# EAGLE design practice (EAGLE 6.2)
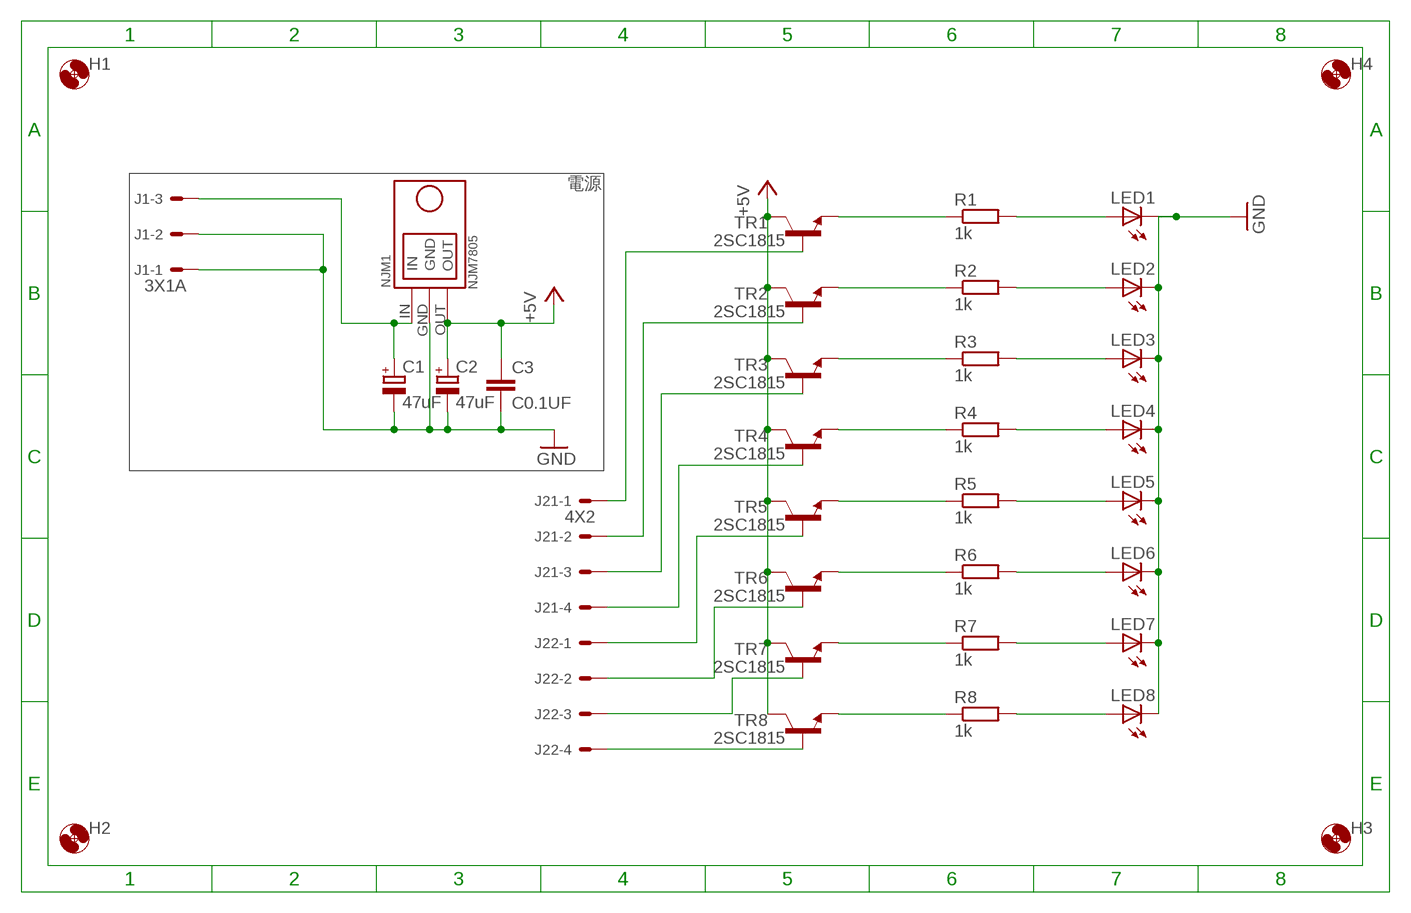
[diagram p0: schematic, sheet 1]

## Parts
C1  47uF  CPOL-EU2-5MM  [E2-5]
C2  47uF  CPOL-EU2-5MM  [E2-5]
C3  C0.1UF  [C0.1UF]
H1  HOLE3.3M3BOLT  [HOLE3.3]
H2  HOLE3.3M3BOLT  [HOLE3.3]
H3  HOLE3.3M3BOLT  [HOLE3.3]
H4  HOLE3.3M3BOLT  [HOLE3.3]
J1  3X1A  [37203-62A3-003]
J2  4X2  [37208-62A3-004]
LED1  LED5MM  [LED5MM]
LED2  LED5MM  [LED5MM]
LED3  LED5MM  [LED5MM]
LED4  LED5MM  [LED5MM]
LED5  LED5MM  [LED5MM]
LED6  LED5MM  [LED5MM]
LED7  LED5MM  [LED5MM]
LED8  LED5MM  [LED5MM]
NJM1  NJM7805  [NJM7805]
R1  1k  R-EU_R3216W  [R3216W]
R2  1k  R-EU_R3216W  [R3216W]
R3  1k  R-EU_R3216W  [R3216W]
R4  1k  R-EU_R3216W  [R3216W]
R5  1k  R-EU_R3216W  [R3216W]
R6  1k  R-EU_R3216W  [R3216W]
R7  1k  R-EU_R3216W  [R3216W]
R8  1k  R-EU_R3216W  [R3216W]
TR1  2SC1815  [TO92-]
TR2  2SC1815  [TO92-]
TR3  2SC1815  [TO92-]
TR4  2SC1815  [TO92-]
TR5  2SC1815  [TO92-]
TR6  2SC1815  [TO92-]
TR7  2SC1815  [TO92-]
TR8  2SC1815  [TO92-]

## Nets
+5V: C2.+ C3.1 NJM1.OUT TR1.C TR2.C TR3.C TR4.C TR5.C TR6.C TR7.C TR8.C
GND: C1.- C2.- C3.2 J1.1-1 J1.1-2 LED1.K(C) LED2.K(C) LED3.K(C) LED4.K(C) LED5.K(C) LED6.K(C) LED7.K(C) LED8.K(C) NJM1.GND
N$1: C1.+ J1.1-3 NJM1.IN
N$2: R1.1 TR1.E
N$3: R2.1 TR2.E
N$4: R3.1 TR3.E
N$5: R4.1 TR4.E
N$6: R5.1 TR5.E
N$7: R6.1 TR6.E
N$8: R7.1 TR7.E
N$9: R8.1 TR8.E
N$10: LED5.A R5.2
N$11: LED6.A R6.2
N$12: LED7.A R7.2
N$13: LED8.A R8.2
N$14: LED1.A R1.2
N$15: LED2.A R2.2
N$16: LED3.A R3.2
N$17: LED4.A R4.2
N$18: J2.1-1 TR1.B
N$19: J2.1-2 TR2.B
N$20: J2.1-3 TR3.B
N$21: J2.1-4 TR4.B
N$22: J2.2-1 TR5.B
N$23: J2.2-2 TR6.B
N$24: J2.2-3 TR7.B
N$25: J2.2-4 TR8.B

## Notes on the sheet
- 電源

## Library data of the parts
C1 C2 = FP-21T for MITS:CPOL-EU2
C3 = FP-21T for MITS:C0.1UF
H1-H4 = FP-21T for MITS:HOLE3.3
J1 = 3M_372xx:3X1
J2 = 3M_372xx:4X2
LED1-LED8 = FP-21T for MITS:LED: LED OSRAM: - CHIPLED LG R971, LG N971, LY N971, LG Q971, LY Q971, LO R971, LY R971 LH N974, LH R974 LS Q976, LO Q976, LY Q976 LO Q996 - Hyper CHIPLED LW Q18S LB Q993, LB Q99A, LB R99A - SideLED LS A670, LO A670, LY A670, LG A670, LP A670 LB A673, LV A673, LT A673, LW A673 LH A674 LY A675 LS A676, LA A676, LO A676, LY A676, LW A676 LS A679, LY A679, LG A679 - Hyper Micro SIDELED® LS Y876, LA Y876, LO Y876, LY Y876 LT Y87S - SmartLED LW L88C, LW L88S LB L89C, LB L89S, LG L890 LS L89K, LO L89K, LY L89K LS L896, LA L896, LO L896, LY L896 - TOPLED LS T670, LO T670, LY T670, LG T670, LP T670 LSG T670, LSP T670, LSY T670, LOP T670, LYG T670 LG T671, LOG T671, LSG T671 LB T673, LV T673, LT T673, LW T673 LH T674 LS T676, LA T676, LO T676, LY T676, LB T676, LH T676, LSB T676, LW T676 LB T67C, LV T67C, LT T67C, LS T67K, LO T67K, LY T67K, LW E67C LS E67B, LA E67B, LO E67B, LY E67B, LB E67C, LV E67C, LT E67C LW T67C LS T679, LY T679, LG T679 LS T770, LO T770, LY T770, LG T770, LP T770 LB T773, LV T773, LT T773, LW T773 LH T774 LS E675, LA E675, LY E675, LS T675 LS T776, LA T776, LO T776, LY T776, LB T776 LHGB T686 LT T68C, LB T68C - Hyper Mini TOPLED® LB M676 - Mini TOPLED Santana® LG M470 LS M47K, LO M47K, LY M47K Source: http://www.osram.convergy.de - LUMILED® LXK2-PW12-R00, LXK2-PW12-S00, LXK2-PW14-U00, LXK2-PW14-V00 LXK2-PM12-R00, LXK2-PM12-S00, LXK2-PM14-U00 LXK2-PE12-Q00, LXK2-PE12-R00, LXK2-PE12-S00, LXK2-PE14-T00, LXK2-PE14-U00 LXK2-PB12-K00, LXK2-PB12-L00, LXK2-PB12-M00, LXK2-PB14-N00, LXK2-PB14-P00, LXK2-PB14-Q00 LXK2-PR12-L00, LXK2-PR12-M00, LXK2-PR14-Q00, LXK2-PR14-R00 LXK2-PD12-Q00, LXK2-PD12-R00, LXK2-PD12-S00 LXK2-PH12-R00, LXK2-PH12-S00 LXK2-PL12-P00, LXK2-PL12-Q00, LXK2-PL12-R00 Source: www.luxeon.com
NJM1 = My_NJM7805:NJM7805
R1-R8 = rcl:R-EU_: RESISTOR, European symbol
TR1-TR8 = FP-21T for MITS:2SC1815

## Board
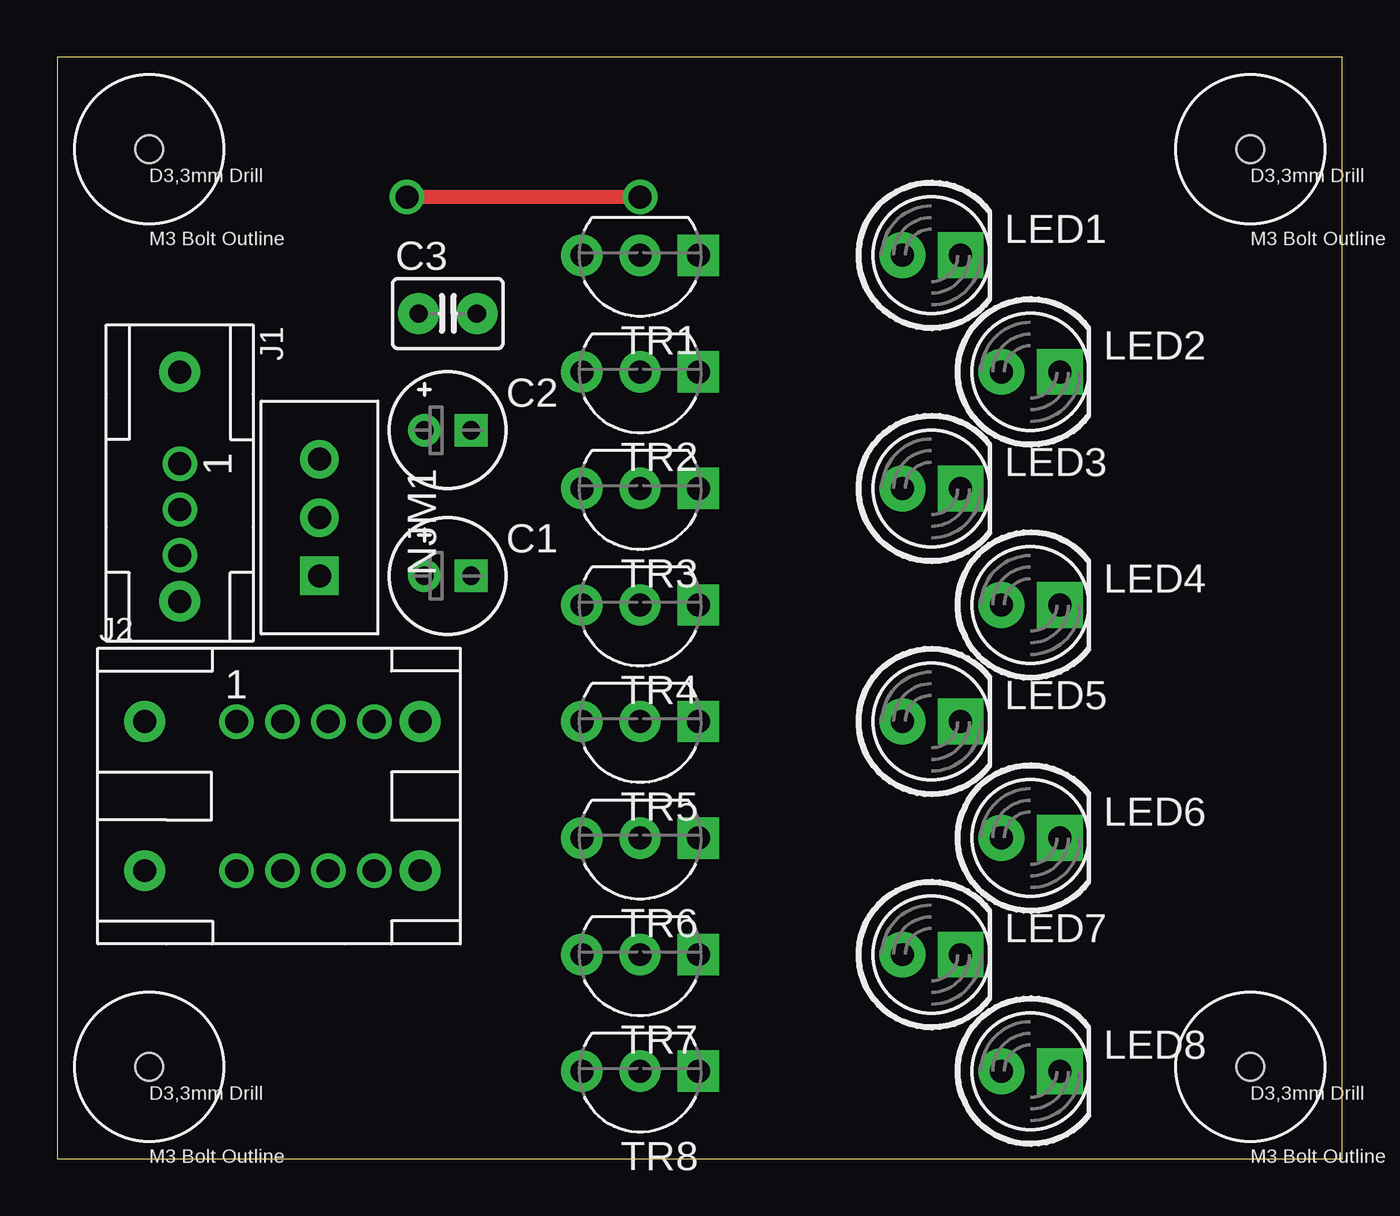
[diagram p1: board, top side]
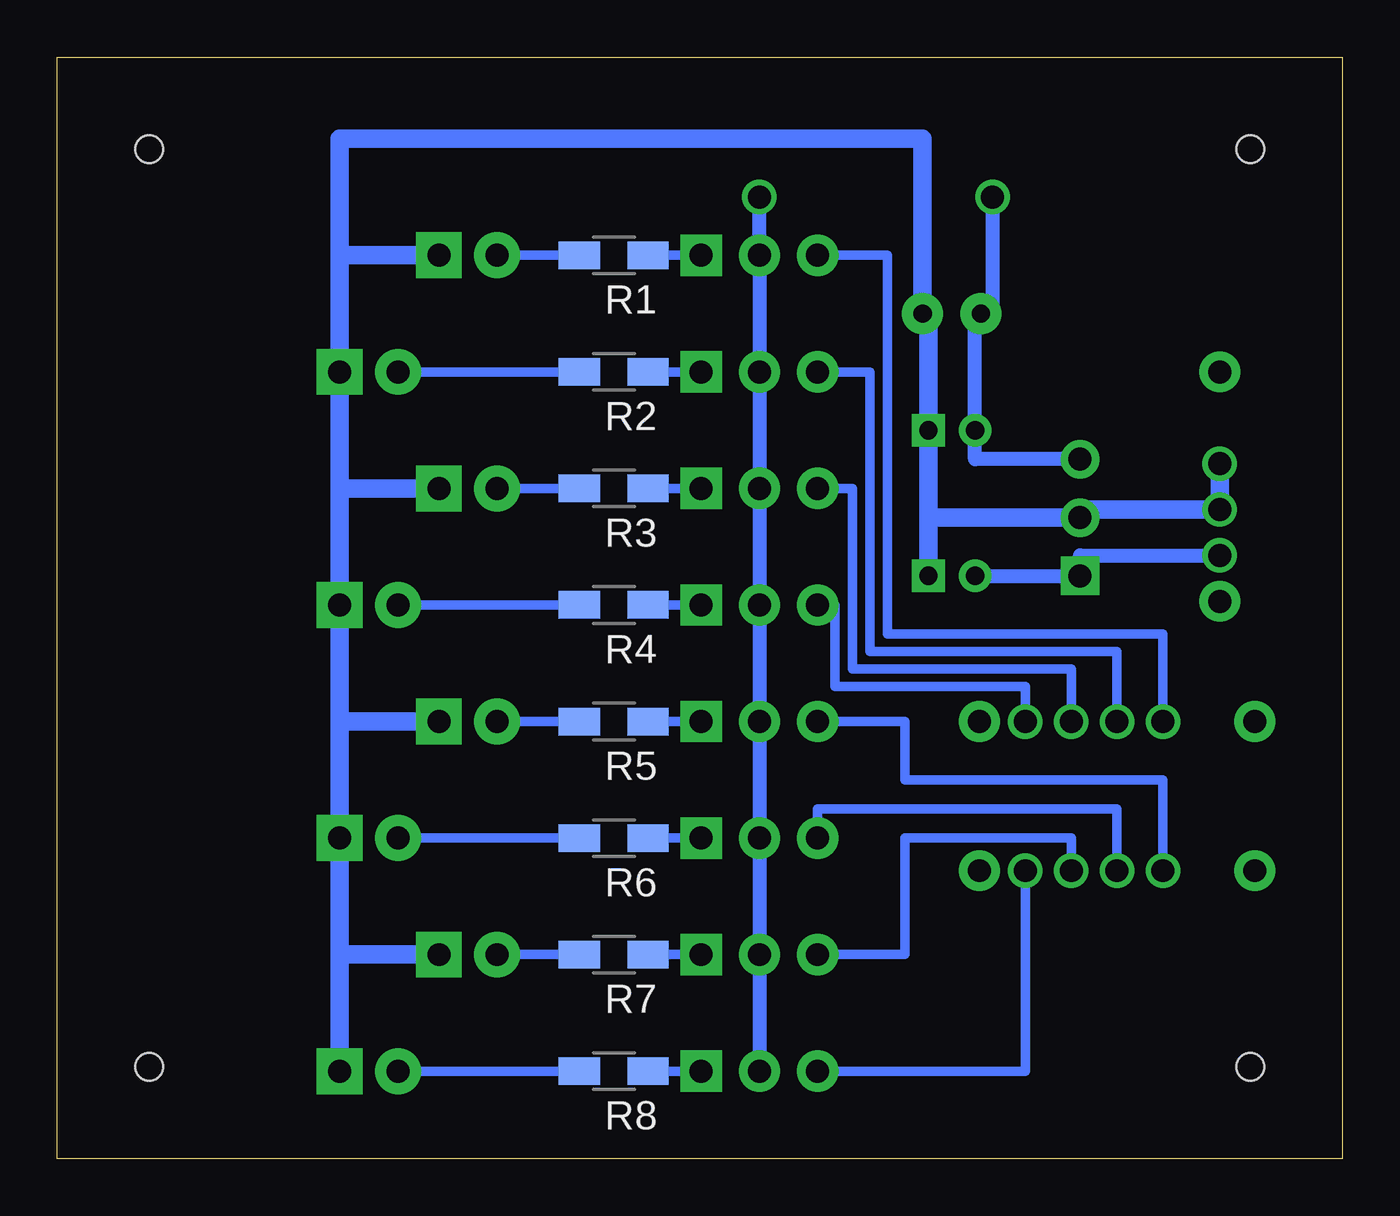
[diagram p2: board, bottom side, seen from below]

Size 56 x 48 mm. Coordinates in mm from the lower left corner, seen from the top.
Outline: 0,0 56,0 56,48 0,48 0,0
Copper layers (1*16): Top 0.035mm / dielectric 1.5mm / Bottom 0.035mm
Design rules: minimum track width 0.15mm, minimum drill 0.3mm, track to track 0.25mm, track to pad 0.25mm, pad to pad 0.25mm, via to via 0.25mm, smd to smd 0.2mm, copper to edge 0.7mm, drill to drill 0.45mm, minimum pad ring 0.15mm, minimum via ring 0.15mm, stop-mask expansion 4mil, vias tented up to drill 0mil, thermal gap 0.15mm

### Footprints (pad centres in the part's own frame; a part is rotated, then mirrored left to right if it is on the bottom)
E2-5 = drill 0.8 pad 1.422: + -1.016,0 | drill 0.8 pad 1.422 square: - 1.016,0
C0.1UF = drill 0.8 pad 1.778: 1 -1.27,0; 2 1.27,0
HOLE3.3 = hole 1.2: 0,0
37203-62A3-003 = drill 1: 1-1 0,4; 1-2 0,6; 1-3 0,8 | drill 1 pad 1.778: P$1 0,0; P$2 0,10
37208-62A3-004 = drill 1: 1-1 0,4; 1-2 0,6; 1-3 0,8; 1-4 0,10; 2-1 6.5,4; 2-2 6.5,6; 2-3 6.5,8; 2-4 6.5,10 | drill 1 pad 1.778: P$1 0,0; P$2 0,12; P$3 6.5,0; P$4 6.5,12
LED5MM = drill 1 pad 2: A -1.27,0 | drill 1 pad 2 square: K 1.27,0
NJM7805 = drill 1 pad 1.676: GND 0,0; OUT 2.54,0 | drill 1 pad 1.676 square: IN -2.54,0
R3216W = smd 1.8 x 1.2: 1 -1.499,0; 2 1.499,0
TO92- = drill 1 pad 1.8: B 2.54,0; C 0,0 | drill 1 pad 1.8 square: E -2.54,0

### Placement (x,y rotation side)
C1  17.02,25.4 0 top
C2  17.02,31.75 0 top
C3  17.02,36.83 0 top
H1  4,4 0 top
H2  52,4 0 top
H3  4,44 0 top
H4  52,44 0 top
J1  5.33,34.29 180 top
J2  3.81,19.05 270 top
LED1  38.1,39.37 0 top
LED2  42.42,34.29 0 top
LED3  38.1,29.21 0 top
LED4  42.42,24.13 0 top
LED5  38.1,19.05 0 top
LED6  42.42,13.97 0 top
LED7  38.1,8.89 0 top
LED8  42.42,3.81 0 top
NJM1  11.43,27.94 90 top
R1  31.75,39.37 180 bottom
R2  31.75,34.29 180 bottom
R3  31.75,29.21 180 bottom
R4  31.75,24.13 180 bottom
R5  31.75,19.05 180 bottom
R6  31.75,13.97 180 bottom
R7  31.75,8.89 180 bottom
R8  31.75,3.81 180 bottom
TR1  25.4,39.37 180 top
TR2  25.4,34.29 180 top
TR3  25.4,29.21 180 top
TR4  25.4,24.13 180 top
TR5  25.4,19.05 180 top
TR6  25.4,13.97 180 top
TR7  25.4,8.89 180 top
TR8  25.4,3.81 180 top

### Tracks (layer width: path | path; a pad name or v marks a point on that pad's centre or on a via)
+5V  (via drill 1)
  Top 0.61: v25.4,41.91 v15.24,41.91
  Bottom 0.61: TR8.C TR7.C TR6.C TR5.C TR4.C TR3.C TR2.C TR1.C v25.4,41.91 | NJM1.OUT 16,30.48 C2.+ 16,36.83 C3.1 15.24,36.83 v15.24,41.91
GND
  Bottom 0.406: C3.2 18.03,36.83 | 11.43,28.29 NJM1.GND
  Bottom 0.813: LED8.K 43.69,8.89 | 43.69,8.89 LED6.K 43.69,19.05 | 43.69,19.05 LED4.K 43.69,29.21 | 43.69,29.21 LED2.K 43.69,39.37 | LED3.K 43.69,29.21 | LED5.K 43.69,19.05 | LED7.K 43.69,8.89 | 43.69,39.37 43.69,44.45 19.05,44.45 18.29,44.45 C3.2 | LED1.K 43.69,39.37 | J1.1-1 J1.1-2 11.43,28.29 | 18.03,36.83 C2.- 18.03,27.94 | 18.03,27.94 C1.- | NJM1.GND 18.03,27.94
N$1
  Bottom 0.61: C1.+ NJM1.IN 11.43,26.29 J1.1-3
N$2
  Bottom 0.406: TR1.E R1.1
N$3
  Bottom 0.406: TR2.E R2.1
N$4
  Bottom 0.406: TR3.E R3.1
N$5
  Bottom 0.406: TR4.E R4.1
N$6
  Bottom 0.406: TR5.E R5.1
N$7
  Bottom 0.406: R6.1 TR6.E
N$8
  Bottom 0.406: R7.1 TR7.E
N$9
  Bottom 0.406: R8.1 TR8.E
N$10
  Bottom 0.406: R5.2 LED5.A
N$11
  Bottom 0.406: R6.2 LED6.A
N$12
  Bottom 0.406: R7.2 LED7.A
N$13
  Bottom 0.406: R8.2 LED8.A
N$14
  Bottom 0.406: R1.2 LED1.A
N$15
  Bottom 0.406: R2.2 LED2.A
N$16
  Bottom 0.406: R3.2 LED3.A
N$17
  Bottom 0.406: R4.2 LED4.A
N$18
  Bottom 0.406: TR1.B 19.81,39.37 19.81,22.86 7.81,22.86 J2.1-1
N$19
  Bottom 0.406: TR2.B 20.57,34.29 20.57,22.1 9.81,22.1 J2.1-2
N$20
  Bottom 0.406: TR3.B 21.34,29.21 21.34,21.59 21.34,21.34 11.94,21.34 11.81,21.34 J2.1-3
N$21
  Bottom 0.406: J2.1-4 13.81,20.57 22.1,20.57 22.1,24.13 TR4.B
N$22
  Bottom 0.406: TR5.B 19.05,19.05 19.05,16.51 7.81,16.51 J2.2-1
N$23
  Bottom 0.406: TR6.B 22.86,15.24 10.16,15.24 9.81,15.24 J2.2-2
N$24
  Bottom 0.406: J2.2-3 11.81,13.97 19.05,13.97 19.05,8.89 TR7.B
N$25
  Bottom 0.406: TR8.B 13.81,3.81 J2.2-4